# Altium project Router V2.2.PrjPcb
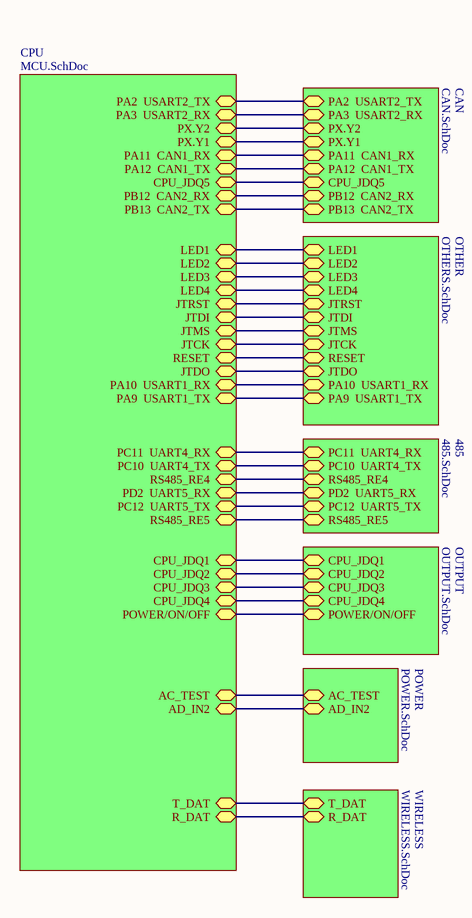
[diagram p0: MAIN.SchDoc]
3 sheets, 53 parts. Net scope: hierarchical (ports join the sheet entries above them; power ports are global).
Board file: PCB1.PcbDoc
Sheets:
  MAIN.SchDoc
    CAN = CAN.SchDoc
    POWER = POWER.SchDoc

## Sheet MAIN.SchDoc
size A4

### Sub-sheets
485 = 485.SchDoc (file not in this document): PC11  UART4_RX, PC10  UART4_TX, RS485_RE4, PD2  UART5_RX, PC12  UART5_TX, RS485_RE5
CAN = CAN.SchDoc: PX.Y1, PA11  CAN1_RX, PA12  CAN1_TX, CPU_JDQ5, PX.Y2, PB12  CAN2_RX, PB13  CAN2_TX, PA2  USART2_TX, PA3  USART2_RX
CPU = MCU.SchDoc (file not in this document): PA2  USART2_TX, PA3  USART2_RX, POWER/ON/OFF, PA9  USART1_TX, PA10  USART1_RX, PA11  CAN1_RX, PA12  CAN1_TX, JTMS, JTCK, JTDI, T_DAT, R_DAT, JTDO, JTRST, PB12  CAN2_RX, PB13  CAN2_TX, RESET, AD_IN2, AC_TEST, CPU_JDQ1, CPU_JDQ2, CPU_JDQ3, CPU_JDQ4, PC10  UART4_TX, PC11  UART4_RX, PC12  UART5_TX, RS485_RE4, RS485_RE5, LED1, LED2, LED3, LED4, PX.Y2, PX.Y1, PD2  UART5_RX, CPU_JDQ5
OTHER = OTHERS.SchDoc (file not in this document): LED1, LED2, LED3, LED4, JTRST, JTDI, JTMS, JTCK, RESET, JTDO, PA10  USART1_RX, PA9  USART1_TX
OUTPUT = OUTPUT.SchDoc (file not in this document): CPU_JDQ1, CPU_JDQ2, CPU_JDQ3, CPU_JDQ4, POWER/ON/OFF
POWER = POWER.SchDoc: AC_TEST, AD_IN2
WIRELESS = WIRELESS.SchDoc (file not in this document): T_DAT, R_DAT

### Nets
AC_TEST: sheet CPU/AC_TEST, sheet POWER/AC_TEST
AD_IN2: sheet CPU/AD_IN2, sheet POWER/AD_IN2
PA11  CAN1_RX: sheet CPU/PA11  CAN1_RX, sheet CAN/PA11  CAN1_RX
PA12  CAN1_TX: sheet CPU/PA12  CAN1_TX, sheet CAN/PA12  CAN1_TX
PX.Y1: sheet CPU/PX.Y1, sheet CAN/PX.Y1
(unnamed): sheet CPU/PA2  USART2_TX, sheet CAN/PA2  USART2_TX
(unnamed): sheet CPU/PA3  USART2_RX, sheet CAN/PA3  USART2_RX
(unnamed): sheet CPU/POWER/ON/OFF, sheet OUTPUT/POWER/ON/OFF
(unnamed): sheet CPU/PA9  USART1_TX, sheet OTHER/PA9  USART1_TX
(unnamed): sheet CPU/PA10  USART1_RX, sheet OTHER/PA10  USART1_RX
(unnamed): sheet CPU/JTMS, sheet OTHER/JTMS
(unnamed): sheet CPU/JTCK, sheet OTHER/JTCK
(unnamed): sheet CPU/JTDI, sheet OTHER/JTDI
(unnamed): sheet CPU/T_DAT, sheet WIRELESS/T_DAT
(unnamed): sheet CPU/R_DAT, sheet WIRELESS/R_DAT
(unnamed): sheet CPU/JTDO, sheet OTHER/JTDO
(unnamed): sheet CPU/JTRST, sheet OTHER/JTRST
(unnamed): sheet CPU/PB12  CAN2_RX, sheet CAN/PB12  CAN2_RX
(unnamed): sheet CPU/PB13  CAN2_TX, sheet CAN/PB13  CAN2_TX
(unnamed): sheet CPU/RESET, sheet OTHER/RESET
(unnamed): sheet CPU/CPU_JDQ1, sheet OUTPUT/CPU_JDQ1
(unnamed): sheet CPU/CPU_JDQ2, sheet OUTPUT/CPU_JDQ2
(unnamed): sheet CPU/CPU_JDQ3, sheet OUTPUT/CPU_JDQ3
(unnamed): sheet CPU/CPU_JDQ4, sheet OUTPUT/CPU_JDQ4
(unnamed): sheet CPU/PC10  UART4_TX, sheet 485/PC10  UART4_TX
(unnamed): sheet CPU/PC11  UART4_RX, sheet 485/PC11  UART4_RX
(unnamed): sheet CPU/PC12  UART5_TX, sheet 485/PC12  UART5_TX
(unnamed): sheet CPU/RS485_RE4, sheet 485/RS485_RE4
(unnamed): sheet CPU/RS485_RE5, sheet 485/RS485_RE5
(unnamed): sheet CPU/LED1, sheet OTHER/LED1
(unnamed): sheet CPU/LED2, sheet OTHER/LED2
(unnamed): sheet CPU/LED3, sheet OTHER/LED3
(unnamed): sheet CPU/LED4, sheet OTHER/LED4
(unnamed): sheet CPU/PX.Y2, sheet CAN/PX.Y2
(unnamed): sheet CPU/PD2  UART5_RX, sheet 485/PD2  UART5_RX
(unnamed): sheet CPU/CPU_JDQ5, sheet CAN/CPU_JDQ5

## Sheet CAN.SchDoc
size A3
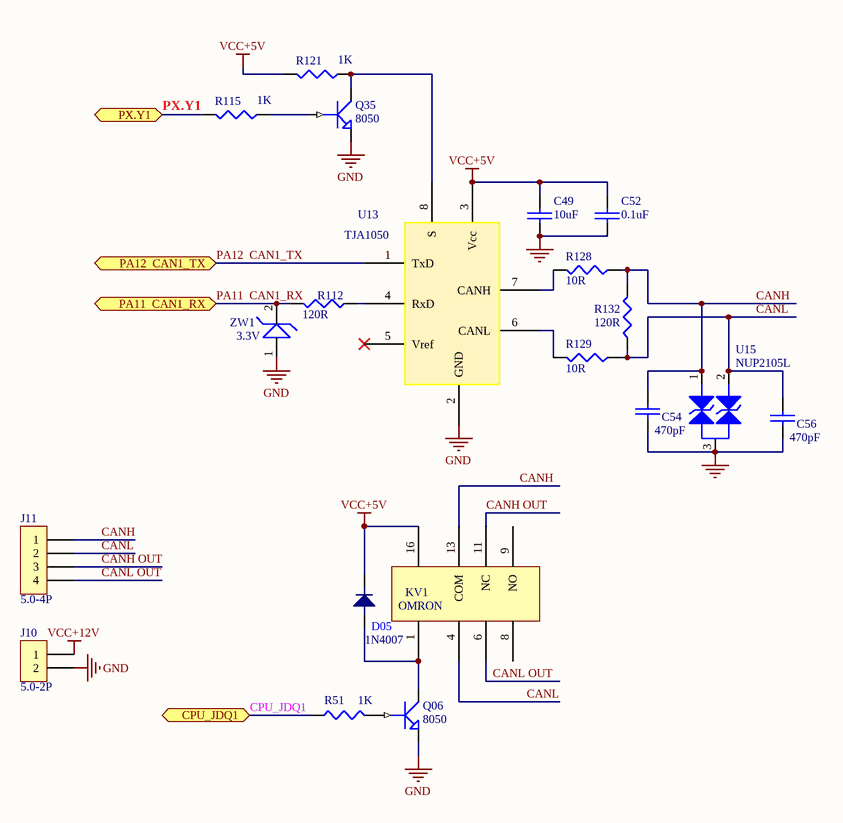
[diagram p1: CAN.SchDoc]

### Parts
C49  10uF  [0805]
C52  0.1uF  [0603]
C54  470pF  [0603]
C56  470pF  [0603]
D05  1N4007  [DO-214AC(SMA)]
J10  5.0-2P  [5.0-2]
J11  5.0-4P  [5.0-4]
KV1  OMRON  [KV]
Q06  8050  [SOT-23]
Q35  8050  [SOT-23]
R51  1K  [0603]
R112  120R  [0603]
R115  1K  [0603]
R121  1K  [0603]
R128  10R  [0603]
R129  10R  [0603]
R132  120R  [0603]
U13  TJA1050  [SO-8]
U15  NUP2105L  [SOT-23]
ZW1  3.3V  [LL-34]

### Ports
CPU_JDQ1, PA11  CAN1_RX, PA12  CAN1_TX, PX.Y1

### Nets
GND: C49.2 C52.1 C54.1 C56.1 J10.2 Q06.2(E) Q35.2(E) U13.2(GND) U15.3 ZW1.1
VCC+5V: C49.1 C52.2 D05.2 KV1.16 R121.2 U13.3(Vcc)
VCC+12V: J10.1
CANH: C54.2 J11.1 KV1.13(COM) R128.1 R132.2 U15.1
CANH OUT: J11.3 KV1.11(NC)
CANL: C56.2 J11.2 KV1.4 R129.1 R132.1 U15.2(K)
CANL OUT: J11.4 KV1.6
CPU_JDQ1: R51.1 ; port CPU_JDQ1
PA11  CAN1_RX: R112.2 ZW1.2 ; port PA11  CAN1_RX
PA12  CAN1_TX: U13.1(TxD) ; port PA12  CAN1_TX
PX.Y1: R115.2 ; port PX.Y1
NetD05_1: D05.1 KV1.1 Q06.3(C)
NetQ06_1: Q06.1(B) R51.2
NetQ35_1: Q35.1(B) R115.1
NetQ35_3: Q35.3(C) R121.1 U13.8(S)
NetR112_1: R112.1 U13.4(RxD)
NetR128_2: R128.2 U13.7(CANH)
NetR129_2: R129.2 U13.6(CANL)

Not connected (* = marked no-connect by the designer): KV1 8(3) 9(NO); U13 5(Vref)*

### Library data of the parts
C49 = CAP-0805: 0805陶瓷贴片电容
C52 C54 C56 = CAP-0603: 0603陶瓷贴片电容
D05 = 1N4007: 1A整流二极管
J10 = 5.0-2P: WJ301V-5.00-2P
J11 = 5.0-4P: WJ301V-5.00-4P
KV1 = OMRON: omron G5V-2 12VDC
Q06 = NPN1
Q35 = 8050: 8050 NPN型三极管
R51 = RES1
R112 R115 R121 R128 R129 R132 = RES-0603: 陶瓷贴片电阻0603封装
U13 = TJA1050: TJA1050   CAN芯片
U15 = NUP2105L: NUP2105L  TVS三极管
ZW1 = 3.3V: ZMM3V3

## Sheet POWER.SchDoc
size A4
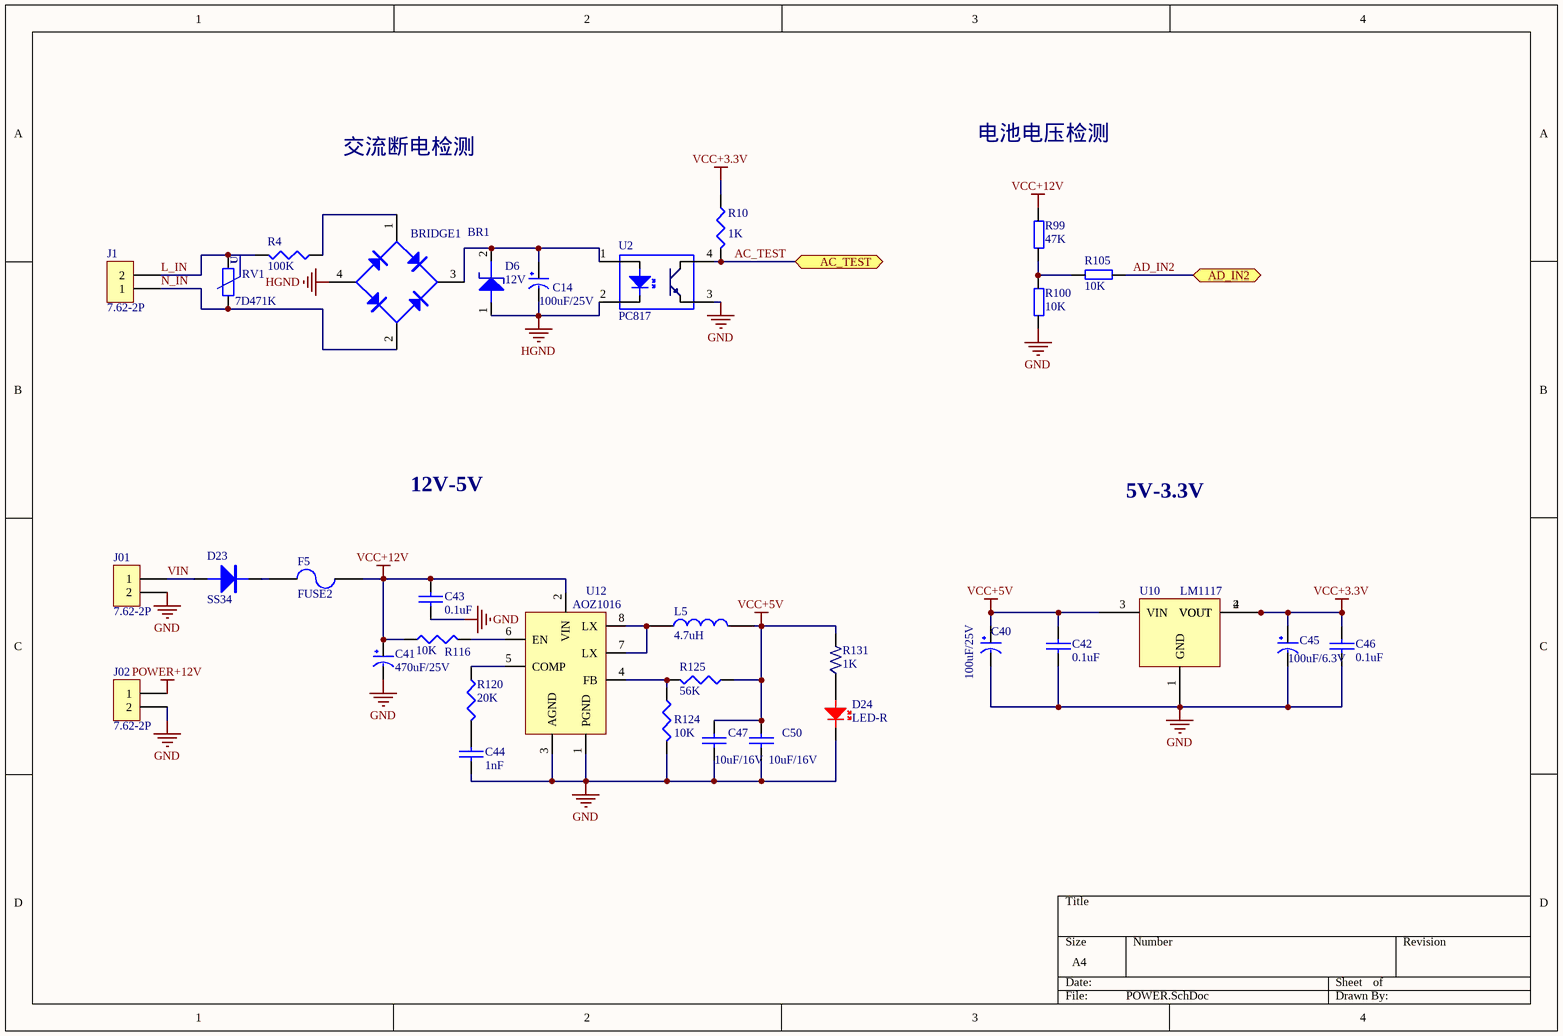
[diagram p2: POWER.SchDoc]

### Parts
BR1  BRIDGE1  [soic-4]
C14  100uF/25V  [RB2.54]
C40  100uF/25V  [RB2.54]
C41  470uF/25V  [RB3.5]
C42  0.1uF  [0603]
C43  0.1uF  [0603]
C44  1nF  [0603]
C45  100uF/6.3V  [RB2.54]
C46  0.1uF  [0603]
C47  10uF/16V  [0805]
C50  10uF/16V  [0805]
D6  12V  [SOD-123A]
D23  SS34  [SMB]
D24  LED-R  [LED-0603]
F5  FUSE2  [FUSE RL60-110]
J1  7.62-2P  [7.62-2]
J01  7.62-2P  [5.08-2P]
J02  7.62-2P  [5.08-2P]
L5  4.7uH  [INDUCTOR 7*7]
R4  100K  [AXIAL0.6]
R10  1K  [0603]
R99  47K  [0603]
R100  10K  [0603]
R105  10K  [0603]
R116  10K  [0603]
R120  20K  [0603]
R124  10K  [0603]
R125  56K  [0603]
R131  1K  [0603]
RV1  7D471K  [7D471]
U2  PC817  [DIP4]
U10  LM1117  [SOT-223]
U12  AOZ1016  [SO-8]

### Ports
AC_TEST, AD_IN2

### Nets
GND: C40.2(GND) C41.2(GND) C42.2 C43.2 C44.2 C45.2(GND) C46.2 C47.2 C50.2 D24.2 J01.2 J02.2 R100.1 R124.2 U2.3 U10.1(GND) U12.1(PGND) U12.3(AGND)
HGND: BR1.4(V-) C14.2(GND) D6.1(A) U2.2
POWER+12V: J02.1
VCC+3.3V: C45.1(VCC) C46.1 R10.1 U10.2(VOUT) U10.4(VOUT)
VCC+5V: C40.1(VCC) C42.1 C47.1 C50.1 L5.2 R125.1 R131.2 U10.3(VIN)
VCC+12V: C41.1(VCC) C43.1 F5.2 R99.2 R116.1 U12.2(VIN)
AC_TEST: R10.2 U2.4 ; port AC_TEST
AD_IN2: R105.1 ; port AD_IN2
L_IN: J1.2 R4.2 RV1.2
N_IN: BR1.2(AC) J1.1 RV1.1
VIN: D23.1(A) J01.1
NetBR1_1: BR1.1(V+) R4.1
NetBR1_3: BR1.3(AC) C14.1(VCC) D6.2(K) U2.1
NetC44_1: C44.1 R120.2
NetD23_2: D23.2(K) F5.1
NetD24_1: D24.1 R131.1
NetL5_1: L5.1 U12.7(LX) U12.8(LX)
NetR99_1: R99.1 R100.2 R105.2
NetR116_2: R116.2 U12.6(EN)
NetR120_1: R120.1 U12.5(COMP)
NetR124_1: R124.1 R125.2 U12.4(FB)

### Notes on the sheet
- 交流断电检测
- 电池电压检测
- 12V-5V
- 5V-3.3V
- (in symbol RV) U

### Library data of the parts
C14 C40-C44 C46 C47 C50 = CAP
C45 = CAP: 钽电容
D6 = Zener Diode
D23 = DIODE
D24 = LED-RED: 绿色LED
F5 = FUSE2: RL60-110
J1 J01 J02 = SIP2A-2.50（带槽）
L5 = INDUCTOR
R4 R10 R116 R120 R124 R125 = RES1
R99 R100 R105 = Res
R131 = RES-1%: 高精度电阻
RV1 = RV
U2 = TLP521: 光耦

## Nets that join several sheets
GND: CAN (10 pins), POWER (18 pins)
VCC+5V: CAN (6 pins), POWER (8 pins)
VCC+12V: CAN (J10.1), POWER (6 pins)